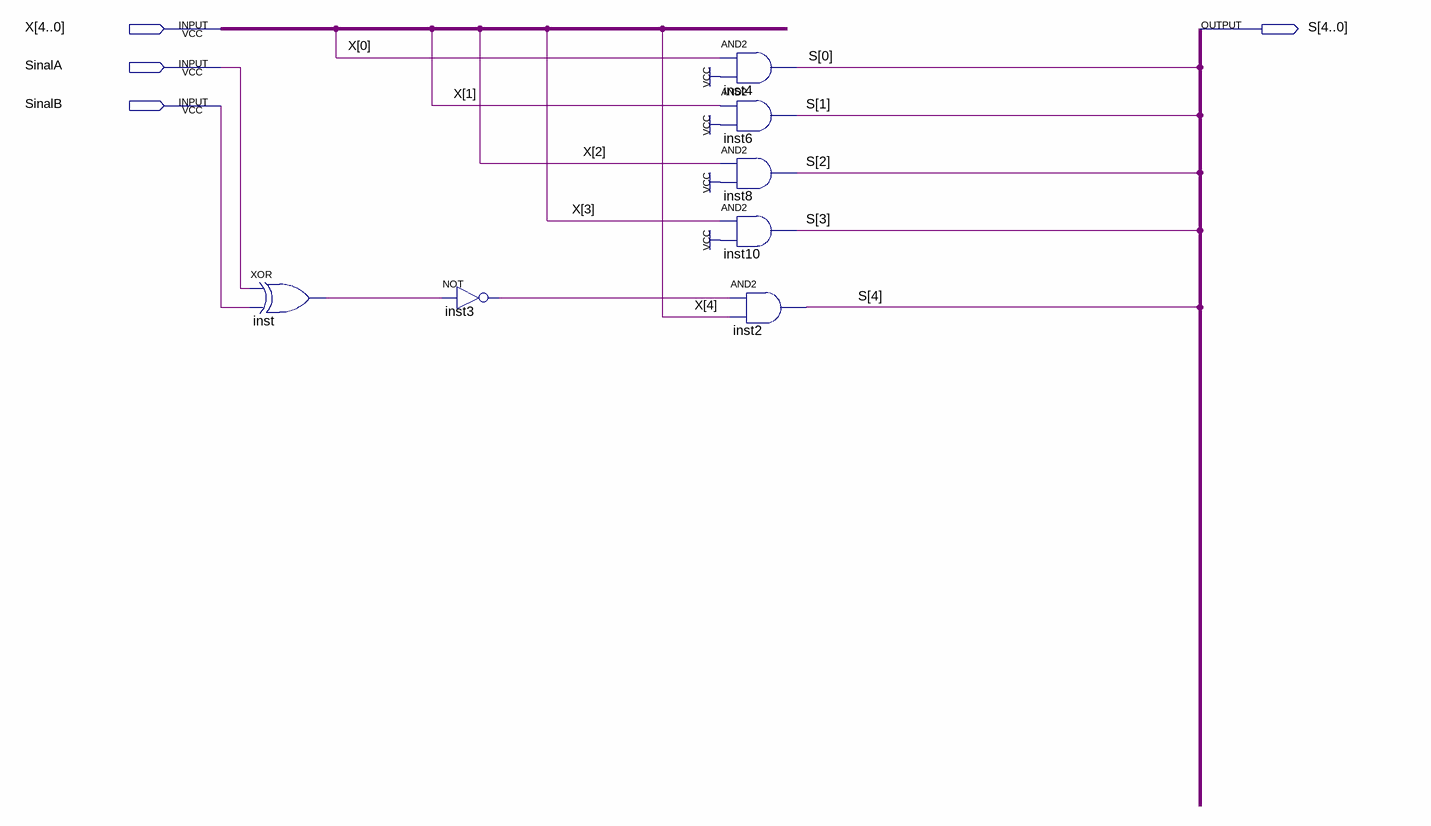
[diagram p0: schematic sheet]
// Quartus schematic SomaFinal.bdf as structural Verilog: 7 symbols, 4 pins
module SomaFinal (
  input  [4:0] X,
  input  SinalA,
  input  SinalB,
  output [4:0] S
);

  wire inst3_out, inst_out;

  xor inst (inst_out, SinalA, SinalB);
  not inst3 (inst3_out, inst_out);
  and inst4 (S[0], X[0], 1'b1);
  and inst6 (S[1], X[1], 1'b1);
  and inst8 (S[2], X[2], 1'b1);
  and inst10 (S[3], X[3], 1'b1);
  and inst2 (S[4], inst3_out, X[4]);
endmodule
